# EAGLE design JOYSTICK (EAGLE 6.1)
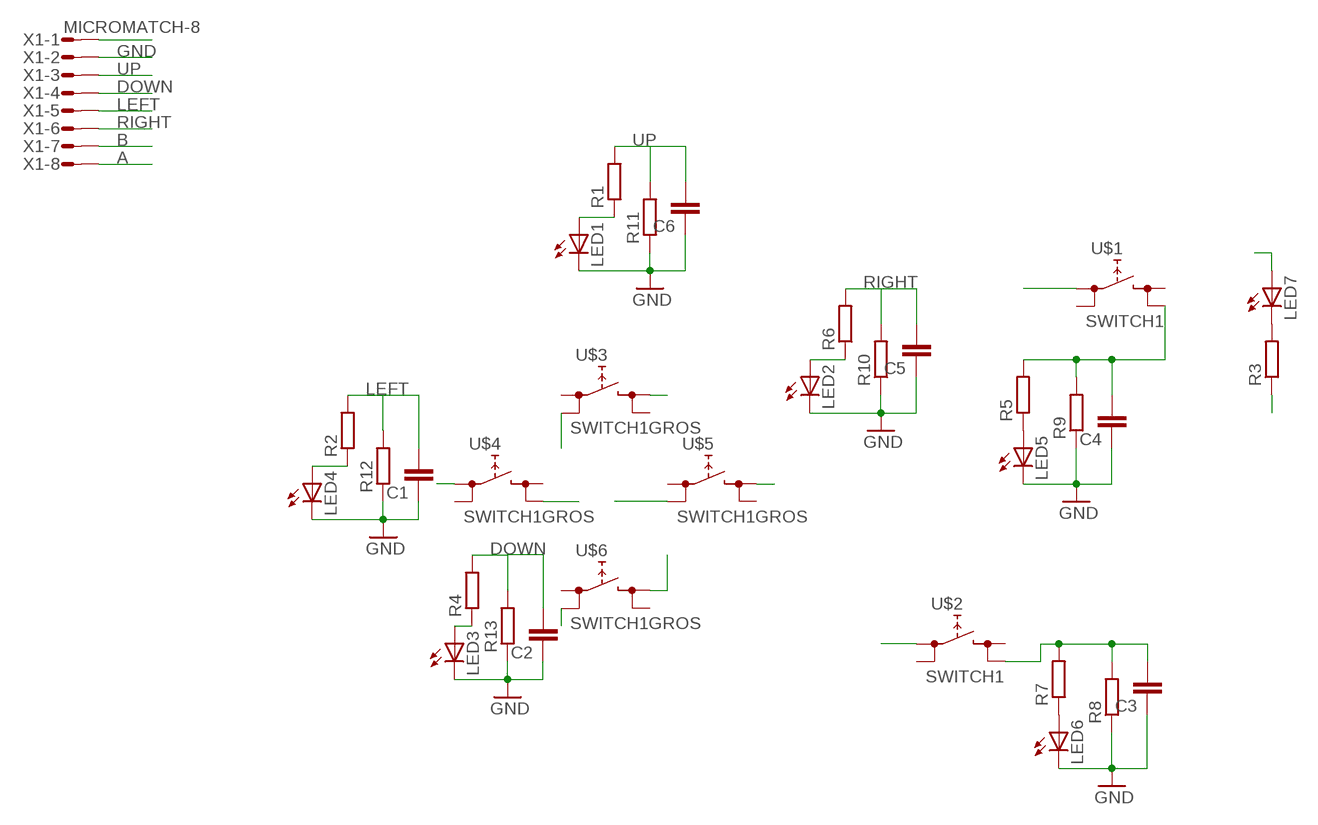
[diagram p0: schematic, sheet 1]

## Parts
C1  C-EUC0805  [C0805]
C2  C-EUC0805  [C0805]
C3  C-EUC0805  [C0805]
C4  C-EUC0805  [C0805]
C5  C-EUC0805  [C0805]
C6  C-EUC0805  [C0805]
LED1  LED3MM  [LED3MM]
LED2  LED3MM  [LED3MM]
LED3  LED3MM  [LED3MM]
LED4  LED3MM  [LED3MM]
LED5  LED3MM  [LED3MM]
LED6  LED3MM  [LED3MM]
LED7  LED3MM  [LED3MM]
R1  R-EU_R0805  [R0805]
R2  R-EU_R0805  [R0805]
R3  R-EU_R0805  [R0805]
R4  R-EU_R0805  [R0805]
R5  R-EU_R0805  [R0805]
R6  R-EU_R0805  [R0805]
R7  R-EU_R0805  [R0805]
R8  R-EU_R0805  [R0805]
R9  R-EU_R0805  [R0805]
R10  R-EU_R0805  [R0805]
R11  R-EU_R0805  [R0805]
R12  R-EU_R0805  [R0805]
R13  R-EU_R0805  [R0805]
U$1  SWITCH1  [TL1105]
U$2  SWITCH1  [TL1105]
U$3  SWITCH1GROS  [REKN]
U$4  SWITCH1GROS  [REKN]
U$5  SWITCH1GROS  [REKN]
U$6  SWITCH1GROS  [REKN]
X1  MICROMATCH-8  [MICROMATCH-8]

## Nets
+5V: LED7.A U$1.1 U$2.1 U$3.1B U$4.2B U$5.1B U$6.2A X1.1
A: C4.2 R5.2 R9.2 U$1.4 X1.8
B: C3.2 R7.2 R8.2 U$2.4 X1.7
DOWN: C2.2 R4.2 R13.2 U$6.1B X1.4
GND: C1.1 C2.1 C3.1 C4.1 C5.1 C6.1 LED1.K(C) LED2.K(C) LED3.K(C) LED4.K(C) LED5.K(C) LED6.K(C) R3.1 R8.1 R9.1 R10.1 R11.1 R12.1 R13.1 X1.2
LEFT: C1.2 R2.2 R12.2 U$4.1A X1.5
N$1: LED1.A R1.1
N$2: LED4.A R2.1
N$3: LED7.K(C) R3.2
N$4: LED3.A R4.1
N$5: LED5.A R5.1
N$6: LED2.A R6.1
N$7: LED6.A R7.1
RIGHT: C5.2 R6.2 R10.2 U$5.2A X1.6
UP: C6.2 R1.2 R11.2 U$3.2A X1.3
Unconnected: U$1.2 U$1.3 U$2.2 U$2.3 U$3.1A U$3.2B U$4.1B U$4.2A U$5.1A U$5.2B U$6.1A U$6.2B

## Library data of the parts
C1-C6 = resistor:C-EU: CAPACITOR, European symbol
LED1-LED7 = led:LED: LED OSRAM: - CHIPLED LG R971, LG N971, LY N971, LG Q971, LY Q971, LO R971, LY R971 LH N974, LH R974 LS Q976, LO Q976, LY Q976 LO Q996 - Hyper CHIPLED LW Q18S LB Q993, LB Q99A, LB R99A - SideLED LS A670, LO A670, LY A670, LG A670, LP A670 LB A673, LV A673, LT A673, LW A673 LH A674 LY A675 LS A676, LA A676, LO A676, LY A676, LW A676 LS A679, LY A679, LG A679 - Hyper Micro SIDELED® LS Y876, LA Y876, LO Y876, LY Y876 LT Y87S - SmartLED LW L88C, LW L88S LB L89C, LB L89S, LG L890 LS L89K, LO L89K, LY L89K LS L896, LA L896, LO L896, LY L896 - TOPLED LS T670, LO T670, LY T670, LG T670, LP T670 LSG T670, LSP T670, LSY T670, LOP T670, LYG T670 LG T671, LOG T671, LSG T671 LB T673, LV T673, LT T673, LW T673 LH T674 LS T676, LA T676, LO T676, LY T676, LB T676, LH T676, LSB T676, LW T676 LB T67C, LV T67C, LT T67C, LS T67K, LO T67K, LY T67K, LW E67C LS E67B, LA E67B, LO E67B, LY E67B, LB E67C, LV E67C, LT E67C LW T67C LS T679, LY T679, LG T679 LS T770, LO T770, LY T770, LG T770, LP T770 LB T773, LV T773, LT T773, LW T773 LH T774 LS E675, LA E675, LY E675, LS T675 LS T776, LA T776, LO T776, LY T776, LB T776 LHGB T686 LT T68C, LB T68C - Hyper Mini TOPLED® LB M676 - Mini TOPLED Santana® LG M470 LS M47K, LO M47K, LY M47K Source: http://www.osram.convergy.de LUXEON: - LUMILED® LXK2-PW12-R00, LXK2-PW12-S00, LXK2-PW14-U00, LXK2-PW14-V00 LXK2-PM12-R00, LXK2-PM12-S00, LXK2-PM14-U00 LXK2-PE12-Q00, LXK2-PE12-R00, LXK2-PE12-S00, LXK2-PE14-T00, LXK2-PE14-U00 LXK2-PB12-K00, LXK2-PB12-L00, LXK2-PB12-M00, LXK2-PB14-N00, LXK2-PB14-P00, LXK2-PB14-Q00 LXK2-PR12-L00, LXK2-PR12-M00, LXK2-PR14-Q00, LXK2-PR14-R00 LXK2-PD12-Q00, LXK2-PD12-R00, LXK2-PD12-S00 LXK2-PH12-R00, LXK2-PH12-S00 LXK2-PL12-P00, LXK2-PL12-Q00, LXK2-PL12-R00 Source: www.luxeon.com KINGBRIGHT: KA-3528ASYC Source: www.kingbright.com
R1-R13 = resistor:R-EU_: RESISTOR, European symbol
U$1-U$6 = SwitchENSEA:SWITCH1
X1 = con-amp-micromatch:MICROMATCH-8: MicroMaTch 8 7-215464-8 / 0-215464-8 Drawing Number C-215464 DDEController.pdf; MF: FARNELL; MPN: 7-215464-8; OC_FARNELL: 3784642; OC_NEWARK: 26H0301

## Board
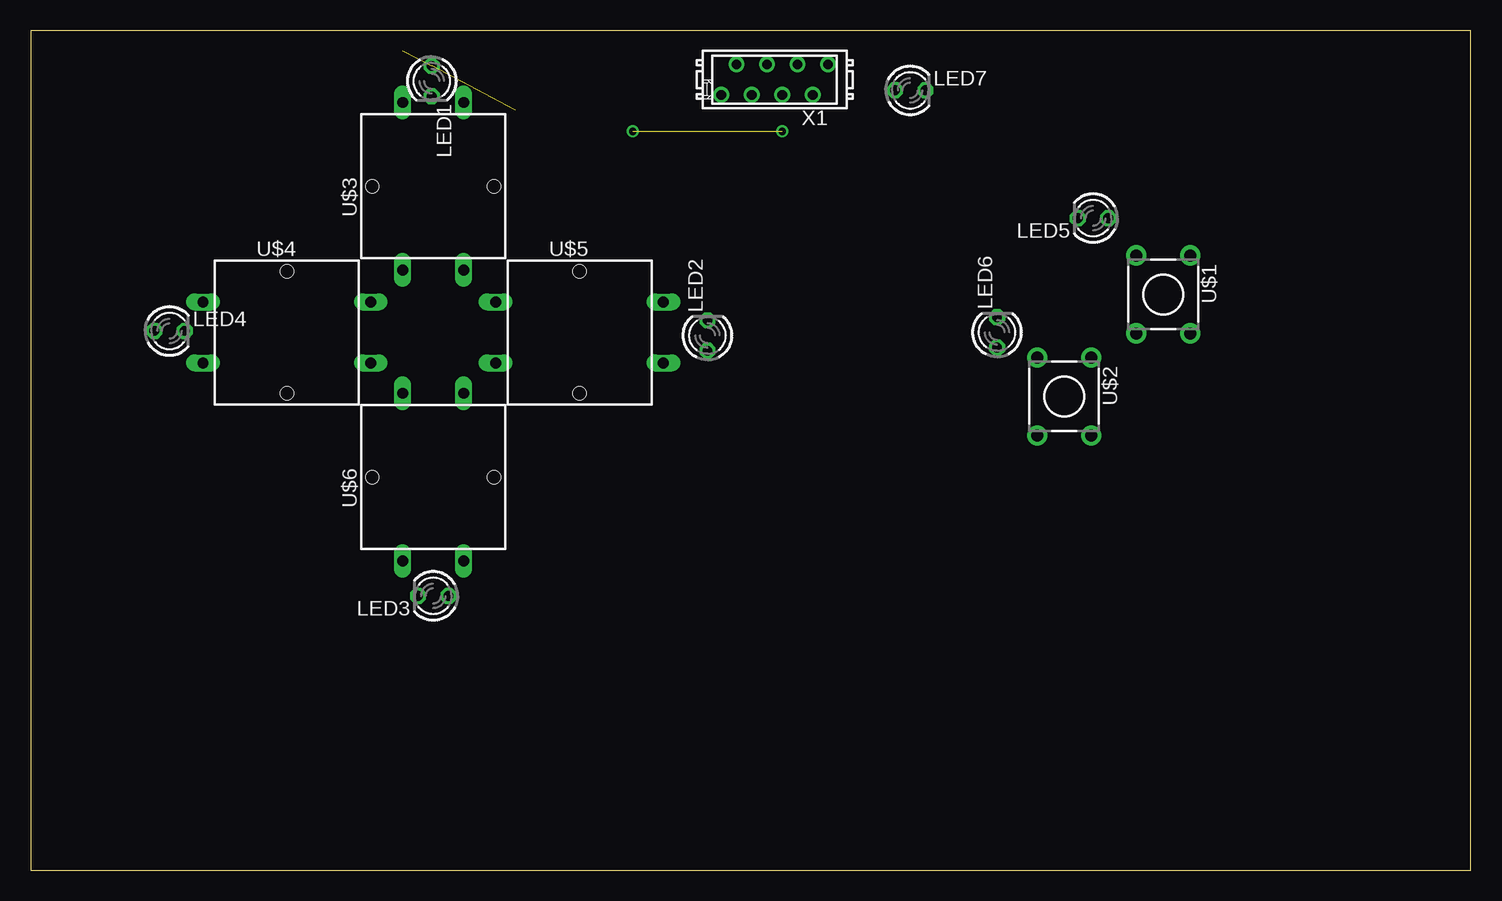
[diagram p1: board, top side]
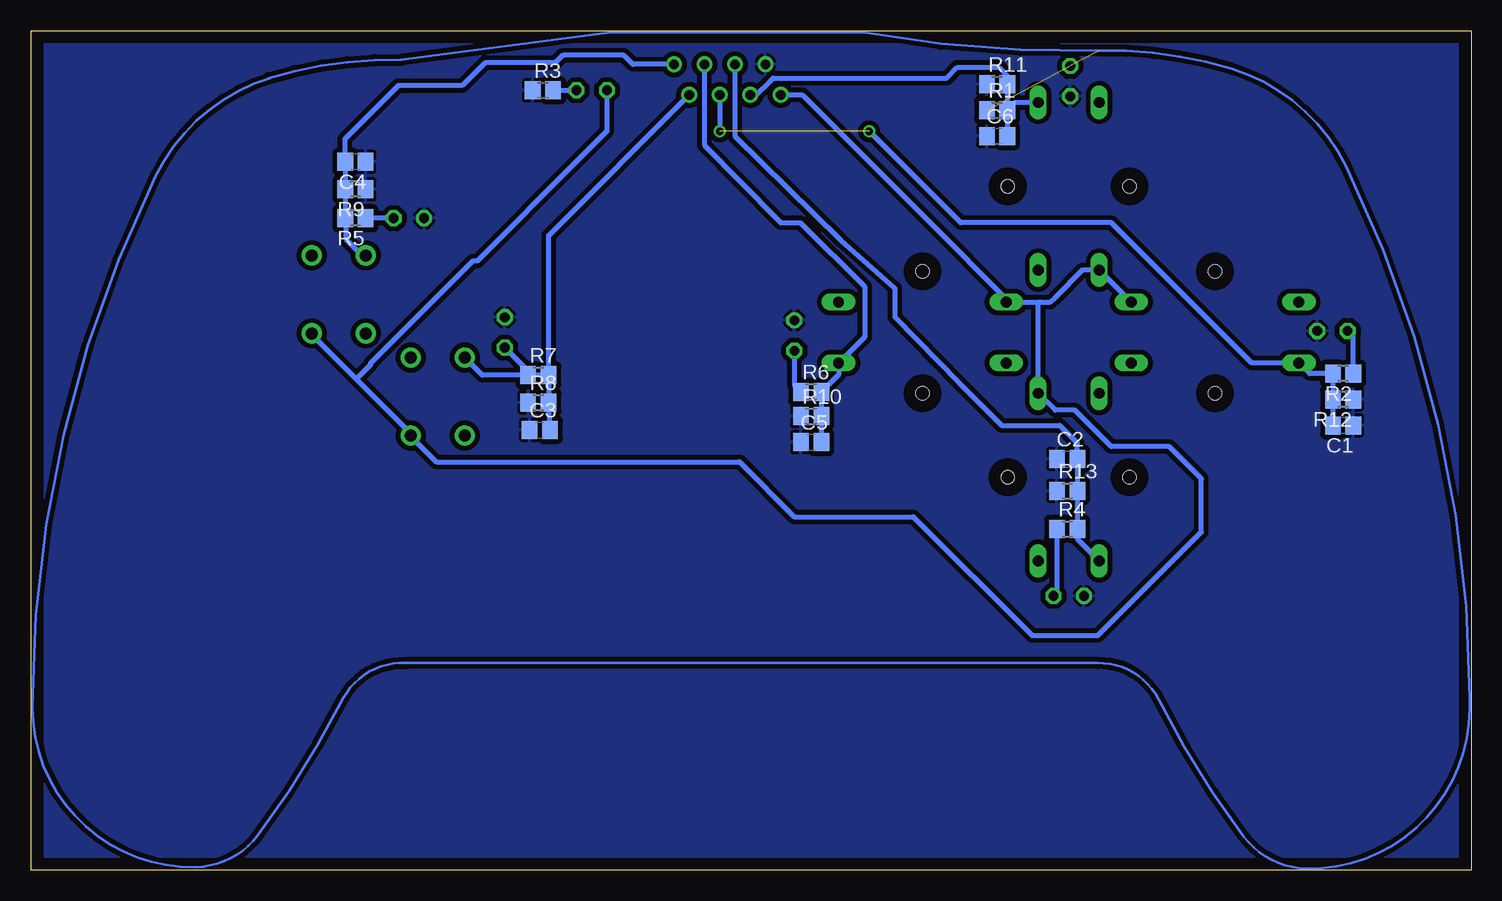
[diagram p2: board, bottom side, seen from below]

Size 120 x 70 mm. Coordinates in mm from the lower left corner, seen from the top.
Outline: 0,0 120,0 120,70 0,70 0,0
Copper layers (1*16): Top 0.035mm / dielectric 1.5mm / Bottom 0.035mm
Design rules: minimum track width 10mil, minimum drill 24mil, track to track 8mil, track to pad 8mil, pad to pad 8mil, via to via 8mil, smd to smd 8mil, copper to edge 40mil, drill to drill 8mil, minimum pad ring 10mil, minimum via ring 8mil, stop-mask expansion 4mil, vias tented up to drill 0mil, thermal gap 10mil

### Footprints (pad centres in the part's own frame; a part is rotated, then mirrored left to right if it is on the bottom)
C0805 = smd 1.3 x 1.5: 1 -0.85,0; 2 0.85,0
LED3MM = drill 0.813 octagon: A -1.27,0; K 1.27,0
R0805 = smd 1.3 x 1.5: 1 -0.85,0; 2 0.85,0
TL1105 = drill 1 pad 1.676: 1 -2.25,3.25; 2 2.25,3.25; 3 -2.25,-3.25; 4 2.25,-3.25
REKN = drill 0.9 long: 1A 2.54,-6.985; 1B -2.54,-6.985; 2A 2.54,6.985; 2B -2.54,6.985 | hole 1.1: -5.08,0; 5.08,0
MICROMATCH-8 = drill 0.813: 1 4.445,1.27; 2 3.175,-1.27; 3 1.905,1.27; 4 0.635,-1.27; 5 -0.635,1.27; 6 -1.905,-1.27; 7 -3.175,1.27; 8 -4.445,-1.27

### Placement (x,y rotation side)
C1  10.67,37.08 180 bottom
C2  33.66,34.29 0 bottom
C3  77.6,36.7 0 bottom
C4  92.96,59.05 180 bottom
C5  54.99,35.69 0 bottom
C6  39.5,61.21 0 bottom
LED1  33.4,65.79 270 top
LED2  56.39,44.58 90 top
LED3  33.53,22.86 180 top
LED4  11.56,44.96 0 top
LED5  88.52,54.36 180 top
LED6  80.52,44.83 90 top
LED7  73.28,65.02 0 top
R1  39.5,63.37 0 bottom
R2  10.67,41.4 180 bottom
R3  77.34,65.02 0 bottom
R4  33.66,28.45 0 bottom
R5  92.96,54.36 180 bottom
R6  54.99,39.88 0 bottom
R7  77.72,41.27 0 bottom
R8  77.72,38.99 0 bottom
R9  92.96,56.77 180 bottom
R10  54.99,37.85 0 bottom
R11  39.5,65.53 0 bottom
R12  10.67,39.24 180 bottom
R13  33.66,31.62 0 bottom
U$1  94.36,48.01 180 top
U$2  86.11,39.5 180 top
U$3  33.53,57.02 0 top
U$4  21.34,44.83 270 top
U$5  45.72,44.83 270 top
U$6  33.53,32.77 0 top
X1  61.98,65.91 180 top

### Tracks (layer width: path | path; a pad name or v marks a point on that pad's centre or on a via)
+5V
  Bottom 0.4: U$4.2B U$3.1B 32.38,50.04 34.67,47.75 35.05,47.37 35.94,47.37 | 35.94,47.37 U$5.1B 38.73,47.62 45.09,53.98 55.75,64.64 X1.1 | 35.94,47.37 36.07,47.24 U$6.2A 34.67,38.35 33.02,38.35 29.97,35.31 25.15,35.31 22.48,32.64 22.48,28.19 31.11,19.56 36.58,19.56 46.48,29.46 56.39,29.46 60.96,34.04 86.23,34.04 88.36,36.16 U$2.1 88.36,36.41 92.9,40.96 | U$1.1 96.61,44.67 93.73,41.78 92.9,40.96 | LED7.A 72.01,61.59 74.42,59.18 82.8,50.8 83.19,50.8 91.69,42.29 91.69,42.16 92.9,40.96
A
  Bottom 0.4: X1.8 69.85,67.18 70.61,67.94 75.69,67.94 76.33,67.31 82.17,67.31 84.07,65.41 89.41,65.41 93.85,60.96 93.85,59.09 C4.2 R9.2 R5.2 93.73,54.27 93.73,52.58 92.4,51.26 U$1.4
B
  Bottom 0.4: C3.2 R8.2 R7.2 | R7.2 82.38,41.27 U$2.4 | R7.2 76.87,52.92 X1.7
DOWN
  Bottom 0.4: X1.4 61.34,61.34 61.34,61.21 52.58,52.58 48.01,48.51 48.01,46.1 42.67,40.64 39.12,37.08 34.29,37.08 33.02,35.81 32.8,35.6 C2.2 R13.2 R4.2 32.8,27.6 U$6.1B
GND
  pour Bottom (isolate 0.406): 0,69.98 120.02,69.98 120.02,0 0,0
LEFT  (via drill 0.6)  (1 unrouted)
  Bottom 0.4: C1.2 R12.2 R2.2 13.46,41.4 U$4.1A 18.29,42.29 29.97,53.98 42.55,53.98 v50.16,61.59 | X1.5 v62.61,61.59
N$1  (2 unrouted)
  Bottom 0.2: 100.08,66.04 arc-47 109.6,57.91 arc-26 119.89,13.59 arc-91 106.3,0.25 arc-52 101.09,2.92 arc-10 93.98,14.35 arc64 88.77,17.27 31.11,17.27 arc64 26.04,14.22 arc-10 18.92,2.79 arc-52 13.72,0.13 arc-91 0.13,13.46 0.13,14.1 0.13,14.35 arc-26 10.41,58.67 arc-47 19.94,66.8 arc-18 30.99,68.33 arc12 50.67,69.85 71.63,69.85 89.15,67.56 arc-18 100.2,66.04
N$2
  Bottom 0.4: R2.1 9.82,44.49 LED4.A
N$3
  Bottom 0.4: R3.2 LED7.K
N$4
  Bottom 0.4: R4.1 34.51,23.15 LED3.A
N$5
  Bottom 0.4: LED5.A R5.1
N$6
  Bottom 0.4: LED2.A 56.39,40.42 R6.1
N$7
  Bottom 0.4: R7.1 78.57,41.62 LED6.A
RIGHT
  Bottom 0.4: X1.6 63.88,61.98 63.88,60.45 57.78,54.23 57.53,53.98 55.88,53.98 50.55,48.64 50.55,44.45 U$5.2A 52.7,41.31 R6.2 R10.2 C5.2
UP
  Bottom 0.4: U$3.2A 38.01,64.01 R1.2 | R1.2 C6.2 | R1.2 R11.2 38.61,65.49 38.61,66.17 39.37,66.93 42.8,66.93 43.69,66.04 58.17,66.04 58.42,65.79 59.56,64.64 X1.3